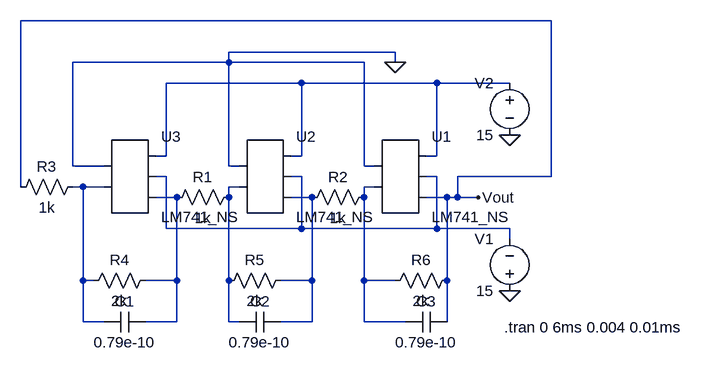
[diagram p0: schematic gvv_ngspice.asc]
gvv_ngspice.asc, the LTspice schematic file:
Version 4
SHEET 1 880 680
WIRE 560 -80 -256 -80
WIRE 320 -32 64 -32
WIRE 64 -16 64 -32
WIRE 64 -16 -176 -16
WIRE 272 -16 64 -16
WIRE 320 -16 320 -32
WIRE 176 16 -32 16
WIRE 384 16 176 16
WIRE 496 16 384 16
WIRE -32 128 -32 16
WIRE -32 128 -48 128
WIRE 176 128 176 16
WIRE 176 128 160 128
WIRE 384 128 384 16
WIRE 384 128 368 128
WIRE -176 144 -176 -16
WIRE -128 144 -176 144
WIRE 64 144 64 -16
WIRE 80 144 64 144
WIRE 272 144 272 -16
WIRE 288 144 272 144
WIRE -32 160 -48 160
WIRE 176 160 160 160
WIRE 384 160 368 160
WIRE 560 160 560 -80
WIRE 560 160 416 160
WIRE -256 176 -256 -80
WIRE -160 176 -176 176
WIRE -128 176 -160 176
WIRE 80 176 64 176
WIRE 288 176 272 176
WIRE -16 192 -48 192
WIRE 64 192 64 176
WIRE 192 192 160 192
WIRE 272 192 272 176
WIRE 400 192 368 192
WIRE 416 192 416 160
WIRE 416 192 400 192
WIRE 448 192 416 192
WIRE -32 240 -32 160
WIRE 176 240 176 160
WIRE 176 240 -32 240
WIRE 384 240 384 160
WIRE 384 240 176 240
WIRE 496 240 384 240
WIRE 496 256 496 240
WIRE -160 320 -160 176
WIRE -144 320 -160 320
WIRE -16 320 -16 192
WIRE -16 320 -64 320
WIRE 64 320 64 192
WIRE 192 320 192 192
WIRE 192 320 144 320
WIRE 272 320 272 192
WIRE 320 320 272 320
WIRE 400 320 400 192
WIRE -160 384 -160 320
WIRE -128 384 -160 384
WIRE -16 384 -16 320
WIRE -16 384 -64 384
WIRE 64 384 64 320
WIRE 80 384 64 384
WIRE 192 384 192 320
WIRE 192 384 144 384
WIRE 272 384 272 320
WIRE 336 384 272 384
WIRE 400 384 400 320
FLAG 496 96 0
FLAG 496 336 0
FLAG 448 192 Vout
FLAG 320 -16 0
SYMBOL AutoGenerated\\LM741_NS 320 160 R0
SYMATTR InstName U1
SYMBOL AutoGenerated\\LM741_NS 112 160 R0
SYMATTR InstName U2
SYMBOL AutoGenerated\\LM741_NS -96 160 R0
SYMATTR InstName U3
SYMBOL voltage 496 352 R180
WINDOW 0 24 96 Left 2
WINDOW 3 24 16 Left 2
WINDOW 123 0 0 Left 2
WINDOW 39 0 0 Left 2
SYMATTR InstName V1
SYMATTR Value 15
SYMBOL voltage 496 0 M0
WINDOW 123 0 0 Left 2
WINDOW 39 0 0 Left 2
SYMATTR InstName V2
SYMATTR Value 15
SYMBOL res 80 176 R90
WINDOW 0 0 56 VBottom 2
WINDOW 3 32 56 VTop 2
SYMATTR InstName R1
SYMATTR Value 1k
SYMBOL res 288 176 R90
WINDOW 0 0 56 VBottom 2
WINDOW 3 32 56 VTop 2
SYMATTR InstName R2
SYMATTR Value 1k
SYMBOL res -160 160 R90
WINDOW 0 0 56 VBottom 2
WINDOW 3 32 56 VTop 2
SYMATTR InstName R3
SYMATTR Value 1k
SYMBOL res -48 304 R90
WINDOW 0 0 56 VBottom 2
WINDOW 3 32 56 VTop 2
SYMATTR InstName R4
SYMATTR Value 2k
SYMBOL res 160 304 R90
WINDOW 0 0 56 VBottom 2
WINDOW 3 32 56 VTop 2
SYMATTR InstName R5
SYMATTR Value 2k
SYMBOL res 416 304 R90
WINDOW 0 0 56 VBottom 2
WINDOW 3 32 56 VTop 2
SYMATTR InstName R6
SYMATTR Value 2k
SYMBOL cap -64 368 R90
WINDOW 0 0 32 VBottom 2
WINDOW 3 32 32 VTop 2
SYMATTR InstName C1
SYMATTR Value 0.79e-10
SYMBOL cap 144 368 R90
WINDOW 0 0 32 VBottom 2
WINDOW 3 32 32 VTop 2
SYMATTR InstName C2
SYMATTR Value 0.79e-10
SYMBOL cap 400 368 R90
WINDOW 0 0 32 VBottom 2
WINDOW 3 32 32 VTop 2
SYMATTR InstName C3
SYMATTR Value 0.79e-10
TEXT 488 392 Left 2 !.tran 0 6ms 0.004 0.01ms

The netlist it stands for:
* gvv_ngspice.asc
* U1: LM741_NS (symbol AutoGenerated\LM741_NS not available, pins judged from their places): pin1=0 pin2=N005 pin3=N001 pin4=N002 pin5=Vout
* U2: LM741_NS (symbol AutoGenerated\LM741_NS not available, pins judged from their places): pin1=0 pin2=N004 pin3=N001 pin4=N002 pin5=N007
* U3: LM741_NS (symbol AutoGenerated\LM741_NS not available, pins judged from their places): pin1=0 pin2=N003 pin3=N001 pin4=N002 pin5=N006
V1 0 N002 15
V2 N001 0 15
R1 N004 N006 1k
R2 N005 N007 1k
R3 N003 Vout 1k
R4 N006 N003 2k
R5 N007 N004 2k
R6 Vout N005 2k
C1 N006 N003 0.79e-10
C2 N007 N004 0.79e-10
C3 Vout N005 0.79e-10
.tran 0 6ms 0.004 0.01ms
.backanno
.end